# EAGLE design uk1122 (EAGLE 6.1)
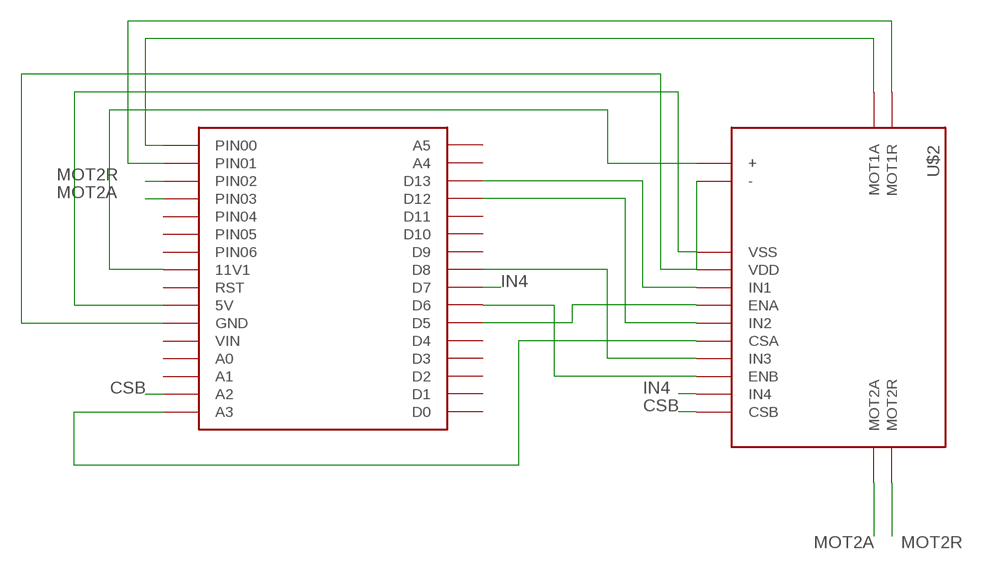
[diagram p0: schematic, sheet 1]

## Parts
U$1  BASE-FINAL  [BASE-FINAL]
U$2  UK1122FINO  [UK1122-2]

## Nets
CSB: U$1.A2 U$2.CSB
IN4: U$1.7(D7) U$2.IN4
MOT2A: U$1.PIN03 U$2.MOT2A
MOT2R: U$1.PIN02 U$2.MOT2R
N$1: U$1.PIN00 U$2.MOT1A
N$2: U$1.PIN01 U$2.MOT1R
N$5: U$1.5V U$2.GND(VSS)
N$6: U$1.12V(11V1) U$2.+
N$7: U$1.13(D13) U$2.IN1
N$8: U$1.12(D12) U$2.EN2(IN2)
N$9: U$1.5(D5) U$2.ENA
N$10: U$1.A3 U$2.CSA
N$11: U$1.8(D8) U$2.IN3
N$13: U$1.6(D6) U$2.ENB
N$21: U$1.GND U$2.+5(VDD) U$2.-
Unconnected: U$1.0(D0) U$1.1(D1) U$1.2(D2) U$1.3(D3) U$1.4(D4) U$1.9(D9) U$1.10(D10) U$1.11(D11) U$1.A0 U$1.A1 U$1.A4 U$1.A5 U$1.PIN04 U$1.PIN05 U$1.PIN06 U$1.RST U$1.VIN

## Library data of the parts
U$1 = aasanchez:BASE-FINAL
U$2 = aasanchez:UK1122

## Board
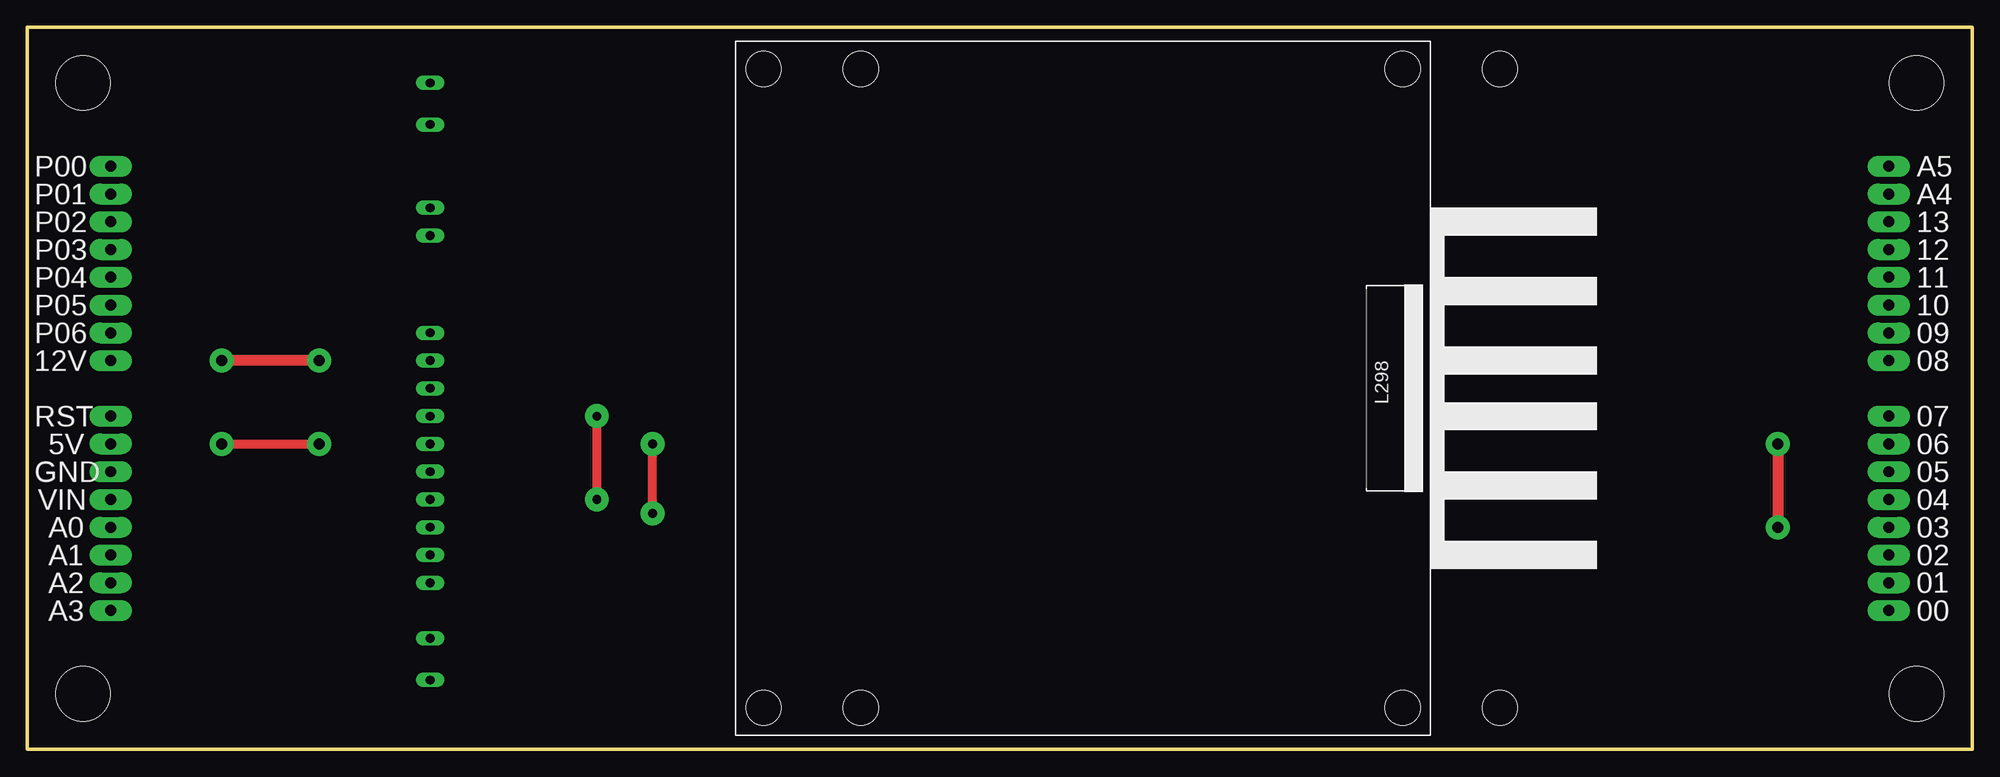
[diagram p1: board, top side]
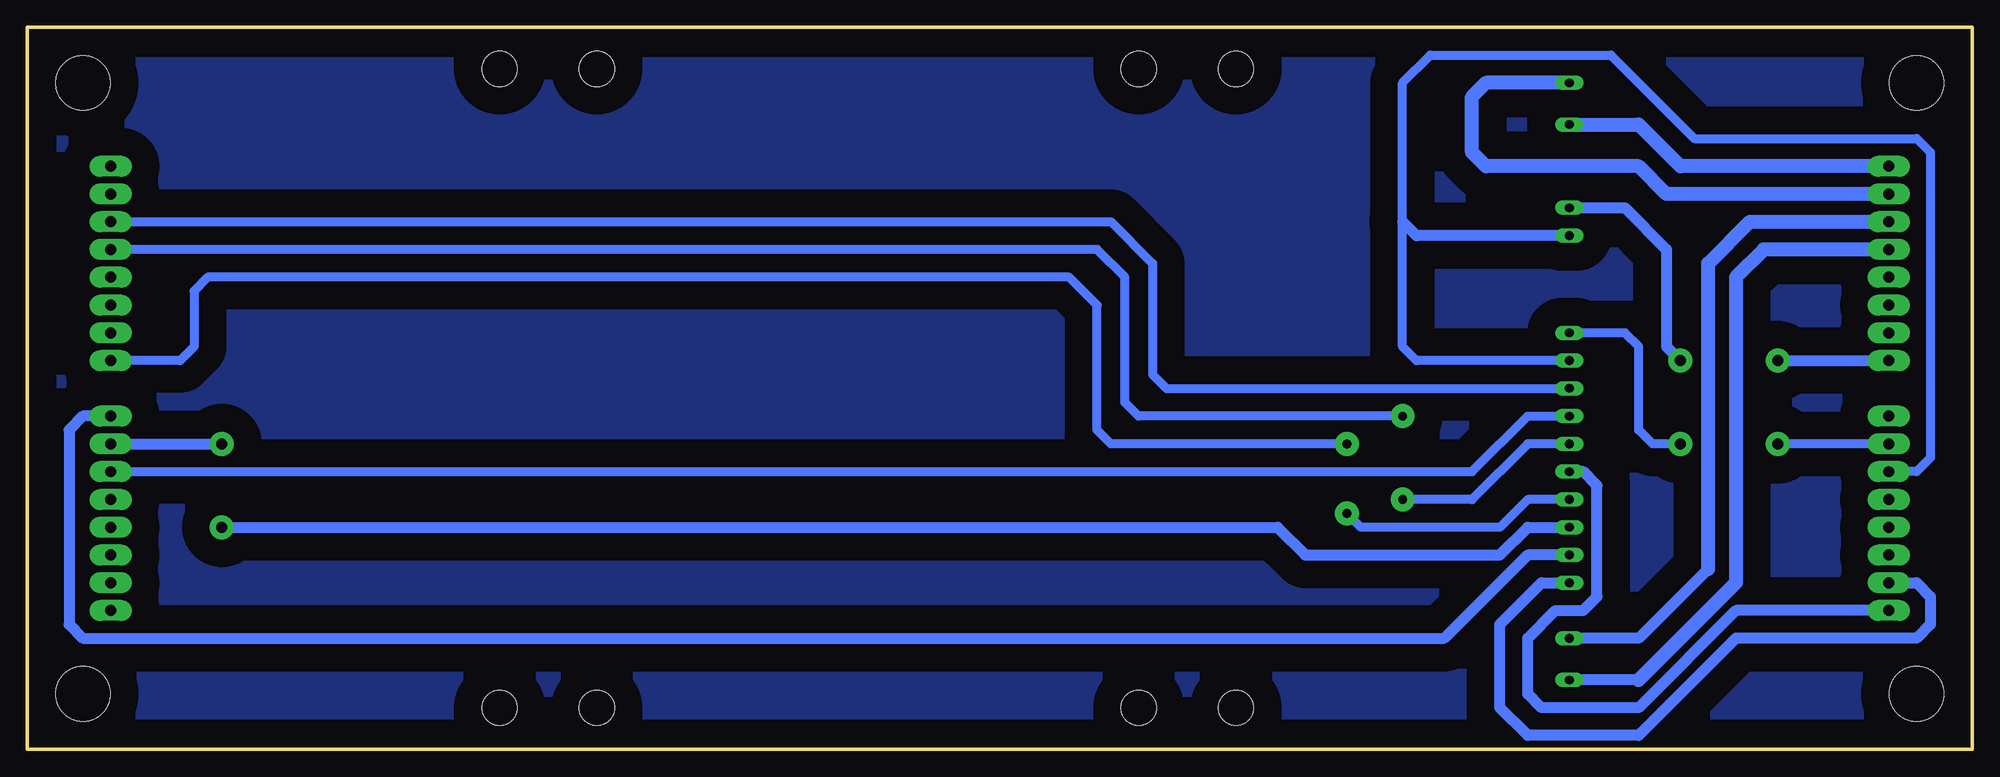
[diagram p2: board, bottom side, seen from below]

Size 177.8 x 66.04 mm. Coordinates in mm from the lower left corner, seen from the top.
Copper layers (1*16): Top 0.035mm / dielectric 1.5mm / Bottom 0.035mm
Design rules: minimum track width 10mil, minimum drill 24mil, track to track 8mil, track to pad 8mil, pad to pad 8mil, via to via 8mil, smd to smd 8mil, copper to edge 40mil, drill to drill 8mil, minimum pad ring 10mil, minimum via ring 8mil, stop-mask expansion 4mil, vias tented up to drill 0mil, thermal gap 10mil
Holes 3.2 mm at 76.2,62.23 134.62,62.23 76.2,3.81 134.62,3.81

### Footprints (pad centres in the part's own frame; a part is rotated, then mirrored left to right if it is on the bottom)
BASE-FINAL = drill 1 pad 1.93 long: 0 81.28,-20.32; 1 81.28,-17.78; 2 81.28,-15.24; 3 81.28,-12.7; 4 81.28,-10.16; 5 81.28,-7.62; 5V -81.28,-5.08; 6 81.28,-5.08; 7 81.28,-2.54; 8 81.28,2.54; 9 81.28,5.08; 10 81.28,7.62; 11 81.28,10.16; 12 81.28,12.7; 12V -81.28,2.54; 13 81.28,15.24; A0 -81.28,-12.7; A1 -81.28,-15.24; A2 -81.28,-17.78; A3 -81.28,-20.32; A4 81.28,17.78; A5 81.28,20.32; GND -81.28,-7.62; PIN00 -81.28,20.32; PIN01 -81.28,17.78; PIN02 -81.28,15.24; PIN03 -81.28,12.7; PIN04 -81.28,10.16; PIN05 -81.28,7.62; PIN06 -81.28,5.08; RST -81.28,-2.54; VIN -81.28,-10.16 | hole 5: -83.82,27.94; -83.82,-27.94; 83.82,-27.94; 83.82,27.94
UK1122-2 = drill 0.8 long: + -17.78,-49.53; +5 -3.81,-49.53; - -15.24,-49.53; CSA 6.35,-49.53; CSB 16.51,-49.53; EN2 3.81,-49.53; ENA 1.27,-49.53; ENB 11.43,-49.53; GND -6.35,-49.53; IN1 -1.27,-49.53; IN3 8.89,-49.53; IN4 13.97,-49.53; MOT1A -25.4,-49.53; MOT1R -29.21,-49.53; MOT2A 25.4,-49.53; MOT2R 21.59,-49.53 | hole 3.2: -30.48,39.37; 27.94,39.37; -30.48,-19.05; 27.94,-19.05

### Placement (x,y rotation side)
U$1  88.9,33.02 0 top
U$2  86.36,31.75 270 top

### Tracks (layer width: path | path; a pad name or v marks a point on that pad's centre or on a via)
CSB
  Bottom 1.016: U$1.A2 5.08,15.24 3.81,13.97 3.81,11.43 5.08,10.16 21.59,10.16 30.48,1.27 40.64,1.27 43.18,3.81 43.18,11.43 39.37,15.24 U$2.CSB
IN4
  Bottom 1.016: U$1.7 172.72,30.48 173.99,29.21 173.99,11.43 172.72,10.16 48.26,10.16 40.64,17.78 U$2.IN4
MOT2A
  Bottom 1.016: 30.48,6.35 U$2.MOT2A
  Bottom 1.27: U$1.PIN03 19.05,45.72 21.59,43.18 21.59,15.24 30.48,6.35
MOT2R
  Bottom 1.016: 24.13,16.51 30.48,10.16 U$2.MOT2R
  Bottom 1.27: 24.13,16.51 24.13,44.45 20.32,48.26 U$1.PIN02
N$1
  Bottom 1.27: U$2.MOT1A 30.48,57.15 26.67,53.34 U$1.PIN00
N$2
  Bottom 1.27: U$1.PIN01 27.94,50.8 30.48,53.34 44.45,53.34 45.72,54.61 45.72,59.69 44.45,60.96 U$2.MOT1R
N$4
  pour Bottom (isolate 2.54): 0,0 177.8,0 177.8,66.04 0,66.04
N$5  (via drill 1 pad 2.18)
  Top 0.813: v17.78,27.94 v26.67,27.94
  Bottom 0.813: U$1.5V v17.78,27.94 | v26.67,27.94 29.21,27.94 30.48,29.21 30.48,36.83 31.75,38.1 U$2.GND
N$6  (via drill 1 pad 2.18)
  Top 1.016: v26.67,35.56 v17.78,35.56
  Bottom 1.016: U$2.+ 31.75,49.53 27.94,45.72 27.94,36.83 v26.67,35.56 | v17.78,35.56 U$1.12V
N$7
  Bottom 0.813: U$1.13 78.74,48.26 74.93,44.45 74.93,34.29 73.66,33.02 U$2.IN1
N$8  (via drill 0.8 pad 2.18)
  Top 0.813: v52.07,22.86 v52.07,30.48
  Bottom 0.813: U$2.EN2 40.64,27.94 45.72,22.86 v52.07,22.86 | v52.07,30.48 76.2,30.48 77.47,31.75 77.47,43.18 80.01,45.72 U$1.12
N$9
  Bottom 0.813: U$1.5 45.72,25.4 40.64,30.48 U$2.ENA
N$10
  Bottom 1.016: U$1.A3 21.59,12.7 30.48,3.81 39.37,3.81 40.64,5.08 40.64,10.16 38.1,12.7 35.56,12.7 34.29,13.97 34.29,24.13 35.56,25.4 U$2.CSA
N$11  (via drill 0.8 pad 2.18)
  Top 0.813: v57.15,21.59 v57.15,27.94
  Bottom 0.813: v57.15,27.94 78.74,27.94 80.01,29.21 80.01,40.64 82.55,43.18 161.29,43.18 162.56,41.91 162.56,36.83 163.83,35.56 U$1.8 | U$2.IN3 40.64,22.86 43.18,20.32 55.88,20.32 v57.15,21.59
N$13  (via drill 1 pad 2.18)
  Top 1.016: v160.02,27.94 v160.02,20.32
  Bottom 1.016: U$1.6 v160.02,27.94 | v160.02,20.32 63.5,20.32 60.96,17.78 43.18,17.78 40.64,20.32 U$2.ENB
N$21
  Bottom 0.813: U$2.+5 50.8,35.56 52.07,36.83 52.07,48.26 52.07,60.96 49.53,63.5 33.02,63.5 25.4,55.88 5.08,55.88 3.81,54.61 3.81,26.67 5.08,25.4 U$1.GND
  Bottom 1.016: U$2.- 50.8,46.99 52.07,48.26